# EAGLE board beltpack_v1 (EAGLE 6.6.0)
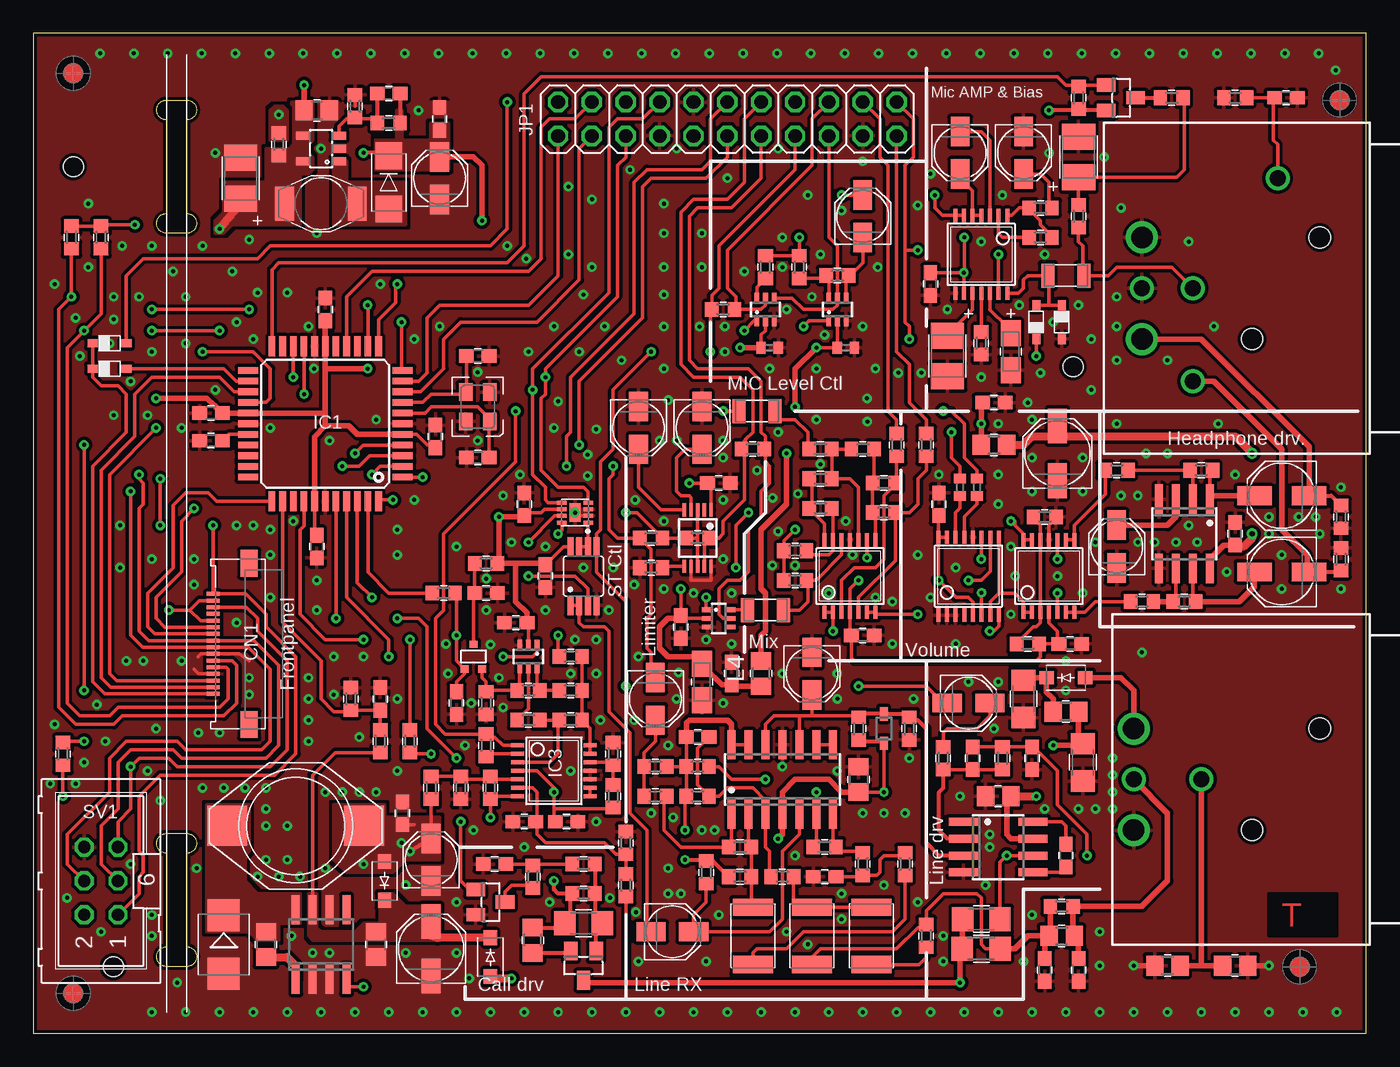
[diagram p5: board, top side]
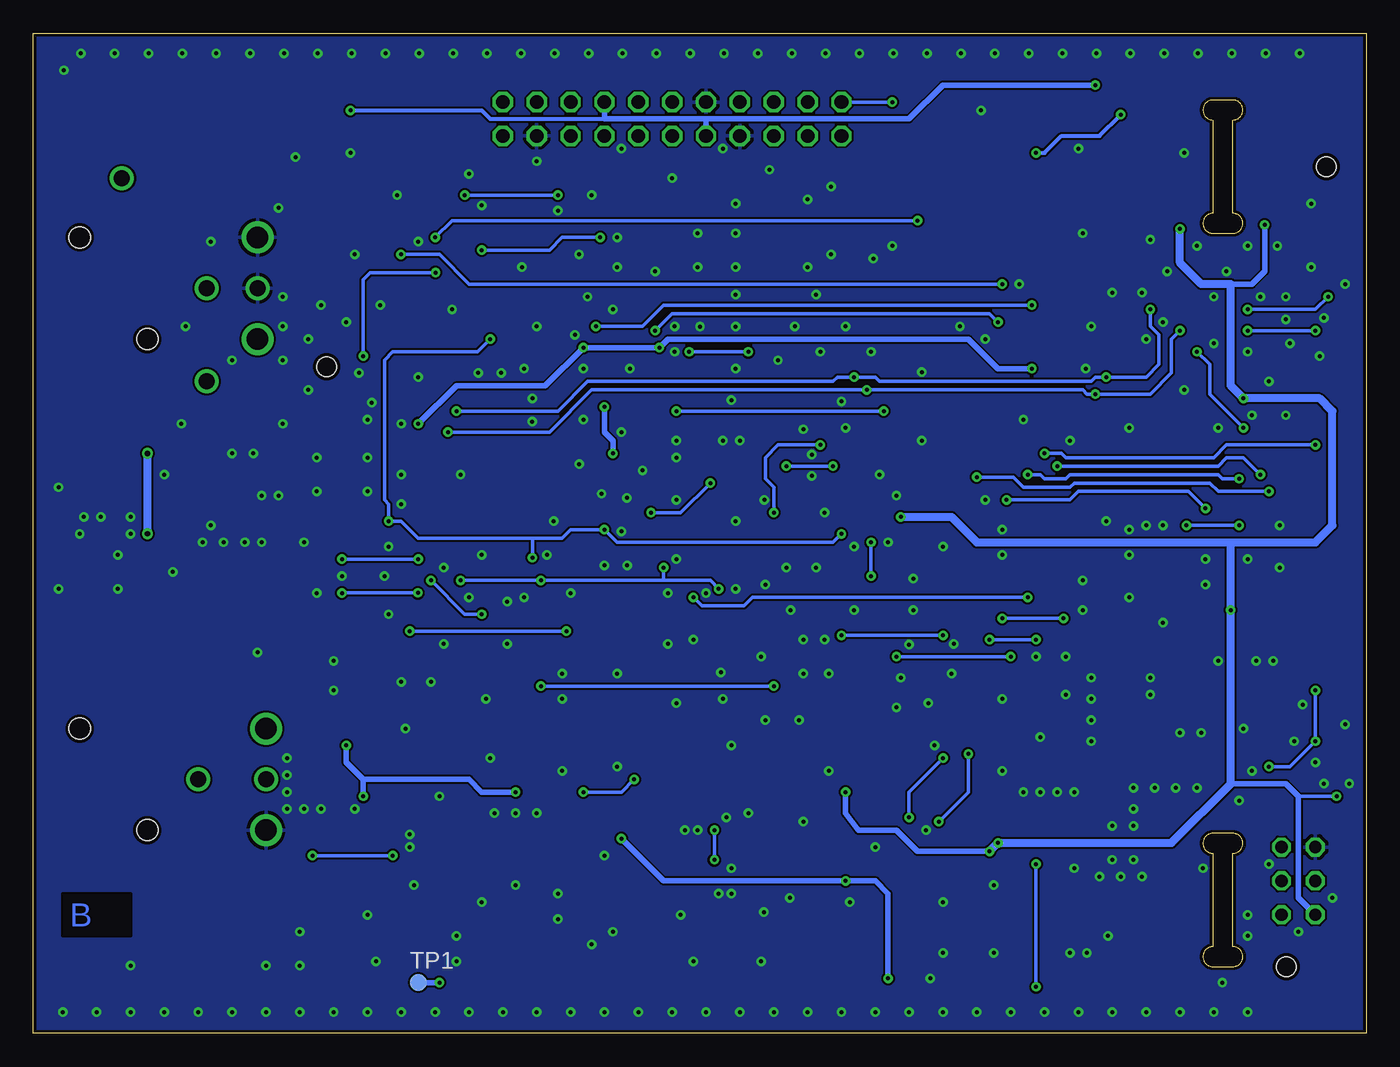
[diagram p6: board, bottom side, seen from below]

Size 100 x 75 mm. Coordinates in mm from the lower left corner, seen from the top.
Outline: 0,0 100,0 100,75 0,75 0,0
Outline: 11.5,5 10,5 arc-90 9.25,5.75 arc-90 10,6.5 10,13.5 arc-90 9.25,14.25 arc-90 10,15 11.5,15 arc-90 12.25,14.25 arc-90 11.5,13.5 11.5,6.5 arc-90 12.25,5.75 arc-90 11.5,5
Outline: 11.5,60 10,60 arc-90 9.25,60.75 arc-90 10,61.5 10,68.5 arc-90 9.25,69.25 arc-90 10,70 11.5,70 arc-90 12.25,69.25 arc-90 11.5,68.5 11.5,61.5 arc-90 12.25,60.75 arc-90 11.5,60
Copper layers (1*16): Top 0.035mm / dielectric 1.5mm / Bottom 0.035mm
Design rules "default *": minimum track width 6mil, minimum drill 0.3mm, track to track 6mil, track to pad 6mil, pad to pad 6mil, via to via 6mil, smd to smd 6mil, copper to edge 0.25mm, drill to drill 8mil, minimum pad ring 10mil, minimum via ring 8mil, stop-mask expansion 4mil, vias tented up to drill 0mil, thermal gap 10mil
Holes 1.5 mm at 3,65 6,5 78,50

## Footprints (pad centres in the part's own frame; a part is rotated, then mirrored left to right if it is on the bottom)
C0603 = smd 1.1 x 1: 1 -0.85,0; 2 0.85,0
C0805 = smd 1.3 x 1.5: 1 -0.95,0; 2 0.95,0
PANASONIC_B = smd 2.2 x 1.4: + 1.6,0; - -1.6,0
C1206 = smd 1.6 x 1.8: 1 -1.4,0; 2 1.4,0
C_PANASONIC_H3 = smd 1 x 1.8: 1 -1.35,0; 2 1.35,0
C0402 = smd 0.7 x 0.9: 1 -0.65,0; 2 0.65,0
PANASONIC_C = smd 2.6 x 1.4: + 2.05,0; - -2.05,0
C_PAN_ECHU_E1 = smd 1.3 x 3: 1 -2.15,0; 2 2.15,0
A/3216-18R = smd 1.95 x 1.5: + 1.375,0; - -1.375,0
B/3528-21R = smd 1.95 x 2.5: + 1.525,0; - -1.525,0
MOLEX-505278-1633 = smd 0.3 x 1: 1 -3.75,1.75; 2 -3.25,1.75; 3 -2.75,1.75; 4 -2.25,1.75; 5 -1.75,1.75; 6 -1.25,1.75; 7 -0.75,1.75; 8 -0.25,1.75; 9 0.25,1.75; 10 0.75,1.75; 11 1.25,1.75; 12 1.75,1.75; 13 2.25,1.75; 14 2.75,1.75; 15 3.25,1.75; 16 3.75,1.75 | smd 2 x 1.3: T1 -6.05,-0.95; T2 6.05,-0.95
SOD323 = smd 1 x 0.6: A 1.1,0; K -1.1,0
DO219AB = smd 1.1 x 1: A -1.45,0; C 1.45,0
SMB = smd 2.4 x 2.4: A 2.2,0; C -2.2,0
SOD323R_INFINEON = smd 0.8 x 0.6: A 1.25,0; C -1.25,0
SMA = smd 2 x 2: A 2,0; C -2,0
TQFP44 = smd 1.5 x 0.5: 1 -5.8,4; 2 -5.8,3.2; 3 -5.8,2.4; 4 -5.8,1.6; 5 -5.8,0.8; 6 -5.8,0; 7 -5.8,-0.8; 8 -5.8,-1.6; 9 -5.8,-2.4; 10 -5.8,-3.2; 11 -5.8,-4; 23 5.8,-4; 24 5.8,-3.2; 25 5.8,-2.4; 26 5.8,-1.6; 27 5.8,-0.8; 28 5.8,0; 29 5.8,0.8; 30 5.8,1.6; 31 5.8,2.4; 32 5.8,3.2; 33 5.8,4 | smd 0.5 x 1.5: 12 -4,-5.8; 13 -3.2,-5.8; 14 -2.4,-5.8; 15 -1.6,-5.8; 16 -0.8,-5.8; 17 0,-5.8; 18 0.8,-5.8; 19 1.6,-5.8; 20 2.4,-5.8; 21 3.2,-5.8; 22 4,-5.8; 34 4,5.8; 35 3.2,5.8; 36 2.4,5.8; 37 1.6,5.8; 38 0.8,5.8; 39 0,5.8; 40 -0.8,5.8; 41 -1.6,5.8; 42 -2.4,5.8; 43 -3.2,5.8; 44 -4,5.8
TSSOP14 = smd 0.305 x 0.991: 1 -1.905,-2.718; 2 -1.27,-2.718; 3 -0.635,-2.718; 4 0,-2.718; 5 0.635,-2.718; 6 1.27,-2.718; 7 1.905,-2.718; 8 1.905,2.718; 9 1.27,2.718; 10 0.635,2.718; 11 0,2.718; 12 -0.635,2.718; 13 -1.27,2.718; 14 -1.905,2.718
TSSOP14' = smd 0.305 x 0.991: 1 -1.95,-2.918; 2 -1.3,-2.918; 3 -0.65,-2.918; 4 0,-2.918; 5 0.65,-2.918; 6 1.3,-2.918; 7 1.95,-2.918; 8 1.95,2.918; 9 1.3,2.918; 10 0.65,2.918; 11 0,2.918; 12 -0.65,2.918; 13 -1.3,2.918; 14 -1.95,2.918
SC70-6L = smd 0.35 x 0.8: 1 -0.65,-0.85; 2 0,-0.85; 3 0.65,-0.85; 4 0.65,0.85; 5 0,0.85; 6 -0.65,0.85
TSSOP16 = smd 0.305 x 0.991: 1 -2.275,-2.918; 2 -1.625,-2.918; 3 -0.975,-2.918; 4 -0.325,-2.918; 5 0.325,-2.918; 6 0.975,-2.918; 7 1.625,-2.918; 8 2.275,-2.918; 9 2.275,2.918; 10 1.625,2.918; 11 0.975,2.918; 12 0.325,2.918; 13 -0.325,2.918; 14 -0.975,2.918; 15 -1.625,2.918; 16 -2.275,2.918
SO08 = smd 0.6 x 2.2: 1 -1.905,-2.6; 2 -0.635,-2.6; 3 0.635,-2.6; 4 1.905,-2.6; 5 1.905,2.6; 6 0.635,2.6; 7 -0.635,2.6; 8 -1.905,2.6
SO14 = smd 0.6 x 2.2: 1 -3.81,-2.6; 2 -2.54,-2.6; 3 -1.27,-2.6; 4 0,-2.6; 5 1.27,-2.6; 6 2.54,-2.6; 7 3.81,-2.6; 8 3.81,2.6; 9 2.54,2.6; 10 1.27,2.6; 11 0,2.6; 12 -1.27,2.6; 13 -2.54,2.6; 14 -3.81,2.6
MSOP10 = smd 0.25 x 1: 1 -1,-2.113; 2 -0.5,-2.113; 3 0,-2.113; 4 0.5,-2.113; 5 1,-2.113; 6 1,2.113; 7 0.5,2.113; 8 0,2.113; 9 -0.5,2.113; 10 -1,2.113
8TDFN-EP = smd 0.7 x 0.3: 1 -0.99,0.75; 2 -0.99,0.25; 3 -0.99,-0.25; 4 -0.99,-0.75; 5 0.99,-0.75; 6 0.99,-0.25; 7 0.99,0.25; 8 0.99,0.75 | smd 0.8 x 1.4: TP 0,0
SOIC8 = smd 0.6 x 2.2: 1 -1.905,-2.6; 2 -0.635,-2.6; 3 0.635,-2.6; 4 1.905,-2.6; 5 1.905,2.6; 6 0.635,2.6; 7 -0.635,2.6; 8 -1.905,2.6
VSOP8 = smd 0.45 x 1.45: 1 -0.975,-2.2; 2 -0.325,-2.2; 3 0.325,-2.2; 4 0.975,-2.2; 5 0.975,2.2; 6 0.325,2.2; 7 -0.325,2.2; 8 -0.975,2.2
SOT23-5 = smd 0.6 x 1.05: 1 -0.95,-1.35; 2 0,-1.35; 3 0.95,-1.35; 4 0.95,1.35; 5 -0.95,1.35
SO-08 = smd 0.6 x 2.2: 1 -1.905,-2.6; 2 -0.635,-2.6; 3 0.635,-2.6; 4 1.905,-2.6; 5 1.905,2.6; 6 0.635,2.6; 7 -0.635,2.6; 8 -1.905,2.6
2X11 = drill 1.016 octagon: 1 -12.7,-1.27; 2 -12.7,1.27; 3 -10.16,-1.27; 4 -10.16,1.27; 5 -7.62,-1.27; 6 -7.62,1.27; 7 -5.08,-1.27; 8 -5.08,1.27; 9 -2.54,-1.27; 10 -2.54,1.27; 11 0,-1.27; 12 0,1.27; 13 2.54,-1.27; 14 2.54,1.27; 15 5.08,-1.27; 16 5.08,1.27; 17 7.62,-1.27; 18 7.62,1.27; 19 10.16,-1.27; 20 10.16,1.27; 21 12.7,-1.27; 22 12.7,1.27
R0805 = smd 1.3 x 1.5: 1 -0.95,0; 2 0.95,0
PISG = smd 1.4 x 2.54: P$1 -2.73,0; P$2 2.73,0
PISM = smd 3 x 3: P$1 -5.15,0; P$2 5.15,0
MT = smd 1.3 x 1: 1 -1.1,-0.9; 2 1.1,-0.9; 3 1.1,0.9; 4 -1.1,0.9
R0603 = smd 1 x 1.1: 1 -0.85,0; 2 0.85,0
R0402 = smd 0.7 x 0.9: 1 -0.65,0; 2 0.65,0
R1206 = smd 1.6 x 1.803: 1 -1.422,0; 2 1.422,0
ML6 = drill 0.914 octagon: 1 -2.54,-1.27; 2 -2.54,1.27; 3 0,-1.27; 4 0,1.27; 5 2.54,-1.27; 6 2.54,1.27
SOT23 = smd 1 x 1.4: 1 -0.95,-1.1; 2 0.95,-1.1; 3 0,1.1
SC70 = smd 0.6 x 0.55: 1 -0.65,-0.925; 2 0.65,-0.925; 3 0,0.925
B1,27 = smd 1.27 x 1.27: TP 0,0
NC3MBH = drill 1.6: 1 3.81,0; 2 -3.81,0 | drill 1.2: 3 0,0; G 0,5.08 | hole 1.6: -3.81,13.97; 3.81,8.89
NC5FAH = drill 1.6: 1 -3.81,-3.815; 5 3.81,-3.815 | drill 1.2: 2 0,0; 3 0,-3.815; 4 6.98,0; G -8.25,6.355 | hole 1.6: 3.81,4.445; -3.81,9.525

## Placement (x,y rotation side)
C1  22p  [C0603]  33.34,43.18 180 top
C2  22p  [C0603]  33.34,50.8 0 top
C3  100n  [C0603]  30.16,44.77 90 top
C4  10n  [C0603]  31.75,24.77 270 top
C5  100n  [C0603]  21.91,54.29 90 top
C6  100n  [C0603]  13.34,44.45 180 top
C7  100n  [C0603]  13.34,46.52 180 top
C8  100n  [C0603]  21.27,36.51 270 top
C9  100n  [C0603]  36.2,30.8 180 top
C10  100n  [C0603]  26.04,25.08 90 top
C11  100n  [C0603]  40.01,15.88 0 top
C12  100n  [C0603]  33.97,33.02 0 top
C13  10n  [C0603]  36.83,15.88 180 top
C14  100n  [C0603]  62.23,29.84 0 top
C15  100n  [C0603]  77.79,29.21 0 top
C16  10n  [C0805]  90.17,5.08 180 top
C17  1µ  [PANASONIC_B]  70.17,24.77 0 top
C18  47p  [C0603]  78.42,4.76 270 top
C19  47p  [C0603]  75.88,4.76 270 top
C20  4µ7  [PANASONIC_B]  58.42,26.99 270 top
C21  100n/50V  [C0805]  72.39,17.78 180 top
C22  39p  [C0603]  70.48,20.64 270 top
C23  1µ  [PANASONIC_B]  47.94,7.62 0 top
C24  20p  [C0603]  77.47,13.34 270 top
C25  39p  [C0603]  74.93,20.64 270 top
C26  1µ/50V  [C1206]  71.12,8.57 180 top
C27  100n/50V  [C0805]  61.91,19.05 90 top
C28  680p  [C0603]  59.37,11.75 0 top
C29  470n ECPU1C474MA5  [C_PANASONIC_H3]  54.29,46.67 0 top
C30  100n  [C0603]  67.94,39.69 90 top
C31  100n/100V  [C1206]  78.74,20.32 270 top
C32  15p  [C0603]  49.85,22.23 180 top
C33  100n  [C0603]  34.61,12.7 180 top
C34  1µ/50V  [C1206]  41.27,8.26 0 top
C35  10µ  [PANASONIC_B]  46.67,25.08 270 top
C36  1µ  [PANASONIC_B]  50.16,45.4 270 top
C37  10µ  [PANASONIC_B]  45.4,45.4 270 top
C38  100n  [C0402]  55.24,51.44 0 top
C39  100n  [C0603]  51.44,41.27 0 top
C40  100n  [C0603]  48.58,30.48 270 top
C41  470n ECPU1C474MA5  [C_PANASONIC_H3]  54.93,31.75 0 top
C42  100n/100V  [C1206]  74.3,25.08 270 top
C43  100n  [C0603]  27.7,16.51 90 top
C44  47µ  [PANASONIC_B]  29.84,13.02 90 top
C45  10µ  [PANASONIC_C]  29.84,6.35 90 top
C46  100n/50V  [C0805]  25.72,6.67 270 top
C47  TMK107BBJ475MA-T  [PANASONIC_B]  30.48,64.14 90 top
C48  470n ECPU1C474MA5  [C_PANASONIC_H3]  77.47,56.83 180 top
C49  10µ  [PANASONIC_B]  74.3,66.04 270 top
C50  1µ  [PANASONIC_B]  81.28,36.51 90 top
C51  100n  [C0603]  90.17,37.47 90 top
C52  100n  [C0603]  72.07,47.31 0 top
C53  22µ  [PANASONIC_C]  76.83,43.5 90 top
C54  100µ/16  [PANASONIC_C]  93.66,40.32 180 top
C55  100µ/16  [PANASONIC_C]  93.66,34.61 180 top
C56  47n/50V  [C_PAN_ECHU_E1]  58.42,7.3 90 top
C57  47n/50V  [C_PAN_ECHU_E1]  53.98,7.3 90 top
C58  47n/50V  [C_PAN_ECHU_E1]  62.87,7.3 90 top
C59  1µ/16  [A/3216-18R]  73.34,51.12 90 top
C60  1µ  [PANASONIC_B]  62.23,61.28 90 top
C61  1µ  [PANASONIC_B]  69.53,66.04 270 top
C62  10µ/20  [B/3528-21R]  68.58,50.8 90 top
C63  100n  [C0402]  60.96,51.44 180 top
C64  100n  [C0603]  67.31,56.2 90 top
C65  1n  [C0603]  93.98,70.17 0 top
C66  1µ/35  [B/3528-21R]  78.42,65.72 270 top
C67  100n  [C0603]  36.83,39.69 90 top
C68  100n  [C0603]  38.42,34.29 270 top
C69  100n  [C0603]  52.39,26.99 90 top
C70  10µ/10V  [A/3216-18R]  50.16,26.35 90 top
C101  22/16  [B/3528-21R]  15.56,64.14 270 top
C102  100n/50  [C0805]  21.27,69.22 0 top
C103  NP  [C0603]  26.67,70.48 180 top
C104  100n  [C0603]  30.48,68.58 90 top
C3007  10nF  [C0805]  17.46,6.67 90 top
CN1  Frontpanel  [MOLEX-505278-1633]  15.24,29.21 90 top
D1  1N4148-WS  [SOD323]  63.82,22.86 90 top
D2  S1GL  [DO219AB]  77.47,26.67 180 top
D3  S1GL  [DO219AB]  26.35,11.43 270 top
D4  MBRS160  [SMB]  14.29,6.67 270 top
D5  BAT42WS  [SOD323R_INFINEON]  75.25,53.34 90 top
D6  BAT42WS  [SOD323R_INFINEON]  77.15,53.34 270 top
D7  BAT42WS  [SOD323R_INFINEON]  5.71,51.75 0 top
D8  BAT42WS  [SOD323R_INFINEON]  5.71,49.85 0 top
D9  S1GL  [DO219AB]  34.29,5.71 90 top
D101  SS16T3  [SMA]  26.67,63.82 270 top
IC1  MEGA32-A  [TQFP44]  21.91,45.72 180 top
IC2  LMV324MZ  [TSSOP14]  61.28,34.29 0 top
IC3  LMV324MZ  [TSSOP14]  39.05,19.68 270 top
IC4  NJM2783  [TSSOP14']  71.12,58.42 180 top
IC5  TS5A9411DCK  [SC70-6L]  37.15,28.26 180 top
IC6  DS1881E  [TSSOP16]  70.17,34.29 0 top
IC7  NE5534D  [SO08]  72.39,13.97 270 top
IC8  TL074D  [SO14]  56.2,19.05 0 top
IC9  NJM2762RB2  [MSOP10]  49.85,37.15 180 top
IC10  TS5A9411DCK  [SC70-6L]  54.93,54.29 0 top
IC11  TS5A9411DCK  [SC70-6L]  51.44,31.11 270 top
IC12  MAX5395LATA+P  [8TDFN-EP]  40.64,39.05 180 top
IC13  LMV324MZ  [TSSOP14]  76.2,34.29 0 top
IC15  TS5A9411DCK  [SC70-6L]  60.33,54.29 0 top
IC16  LM4880M  [SOIC8]  86.36,37.47 180 top
IC17  LMV358DGK  [VSOP8]  41.27,34.29 0 top
IC101  LMR64010  [SOT23-5]  21.59,66.36 90 top
IC3001  LM2675-5.0  [SO-08]  21.59,6.67 0 top
JP1  [2X11]  52.07,68.58 0 top
L1  L200R  [R0805]  77.15,7.3 0 top
L2  L200R  [R0805]  72.07,44.13 0 top
L3  200R  [R0805]  77.47,24.13 180 top
L4  200R  [R0805]  54.61,26.99 90 top
L101  22µH  [PISG]  21.59,62.23 0 top
L3001  47µH  [PISM]  19.68,15.56 0 top
Q1  16M  [MT]  33.34,46.99 90 top
R1  4k7  [R0603]  30.8,33.02 0 top
R2  470  [R0603]  33.97,24.77 90 top
R3  22k  [R0603]  2.22,20.95 90 top
R4  47k  [R0603]  40.32,28.26 0 top
R5  6k8  [R0603]  37.15,25.72 180 top
R6  1k  [R0603]  40.32,25.72 180 top
R7  22  [R0402]  69.53,40.96 270 top
R8  22  [R0402]  70.8,40.96 270 top
R9  220k  [R0603]  40.32,23.5 180 top
R10  2k2  [R0603]  37.15,23.5 0 top
R11  2k2  [R0603]  33.97,21.59 90 top
R12  15k  [R0603]  26.04,21.91 270 top
R13  1k  [R0603]  23.81,25.08 270 top
R14  22k  [R0603]  29.84,18.41 270 top
R15  2k2  [R0603]  32.07,18.41 90 top
R16  22k  [R0603]  44.45,11.11 270 top
R17  2k2  [R0603]  44.45,14.29 270 top
R18  100k  [R0603]  34.29,18.41 270 top
R19  NB  [R0603]  49.85,37.15 0 top
R20  2k2  [R0603]  43.5,17.78 270 top
R21  2k2  [R0603]  43.5,20.95 270 top
R22  100  [R0603]  33.97,35.24 0 top
R23  22k  [R0603]  71.12,51.75 90 top
R24  NB  [R0603]  18.41,66.67 90 top
R25  10k  [R0603]  75.56,59.69 180 top
R26  330  [R0603]  75.56,61.91 180 top
R27  2k2  [R0603]  60.33,56.83 180 top
R28  100k  [R0603]  90.17,70.17 0 top
R29  220k  [R0603]  61.91,22.86 270 top
R30  220k  [R0603]  65.72,22.86 90 top
R31  100k  [R0805]  85.09,5.08 180 top
R32  10k  [R0603]  68.26,20.64 270 top
R33  470  [R0603]  77.15,9.53 180 top
R35  1k  [R0603]  57.47,57.47 90 top
R36  10k  [R0603]  72.71,20.64 90 top
R37  47k  [R0603]  50.48,12.06 270 top
R38  2k2  [R0603]  49.85,20 0 top
R39  2k2  [R0603]  59.37,13.97 0 top
R40  1k5  [R1206]  71.12,6.35 0 top
R41  2k2  [R0603]  62.23,12.7 270 top
R42  56k  [R0603]  65.41,12.7 90 top
R43  0  [R0603]  51.75,54.29 180 top
R44  6k8  [R0603]  53.02,11.75 180 top
R45  43k  [R0603]  56.2,11.75 180 top
R46  10k  [R0603]  28.26,21.91 270 top
R47  68k  [R0603]  49.85,17.78 0 top
R48  20k  [R0603]  53.02,13.97 0 top
R49  47k  [R0603]  37.47,11.75 90 top
R50  47k  [R0603]  41.27,12.7 0 top
R51  1k5  [R0603]  46.67,17.78 180 top
R52  2k2  [R0603]  46.67,20 180 top
R53  18k  [R0603]  41.27,10.48 180 top
R54  470  [R0805]  37.47,6.99 90 top
R55  0  [R0603]  46.35,37.15 180 top
R56  22k  [R0603]  46.35,34.92 0 top
R57  22k  [R0603]  54.93,57.47 270 top
R58  0  [R0603]  53.98,43.81 0 top
R59  100k  [R0603]  57.15,33.97 180 top
R60  4k7  [R0603]  57.15,36.2 0 top
R61  47k  [R0603]  59.05,39.37 180 top
R62  33k  [R0603]  59.05,43.81 0 top
R63  22k  [R0603]  59.05,41.59 0 top
R64  NB  [R0603]  62.23,43.81 0 top
R65  1k  [R0603]  66.99,44.13 270 top
R66  1k  [R0603]  64.77,44.13 270 top
R67  1k  [R0603]  63.82,39.05 0 top
R68  1k  [R0603]  63.82,41.27 0 top
R69  10k  [R0603]  78.42,61.28 90 top
R70  100  [R0603]  85.41,70.17 180 top
R71  22k  [R0603]  78.42,70.17 270 top
R72  10k  [R0603]  5.08,59.69 90 top
R73  10k  [R0603]  2.86,59.69 90 top
R74  10k  [R0603]  75.88,38.73 180 top
R75  22k  [R0603]  81.28,42.23 0 top
R76  22k  [R0603]  83.19,32.38 0 top
R77  10k  [R0603]  74.61,29.21 0 top
R78  22k  [R0603]  87.63,42.23 0 top
R79  22k  [R0603]  86.36,32.38 0 top
R80  22k  [R0603]  98.11,38.73 90 top
R81  22k  [R0603]  98.11,35.56 270 top
R82  47k  [R0603]  66.99,7.3 270 top
R102  1k  [R0603]  24.13,69.53 270 top
R103  5k1  [R0603]  26.67,68.26 0 top
SV1  ISP  [ML6]  5.08,11.43 90 top
T2  BC847  [SOT23]  34.29,9.84 270 top
T3  MMBTA92  [SOT23]  41.27,5.08 180 top
T4  BC847-SC70  [SC70]  33.02,28.26 0 top
T5  IRLML5203  [SOT23]  81.6,70.17 270 top
TP1  XA  [B1,27]  71.12,3.81 0 bottom
U$1  [FIDUCIAL_G15]  3,3 0 top
U$2  [FIDUCIAL_G15]  3,72 0 top
U$3  [FIDUCIAL_G15]  95,5 0 top
U$4  [FIDUCIAL_G15]  98,70 0 top
X2  NC3MBH  [NC3MBH]  82.55,19.05 270 top
X3  NC5FAH  [NC5FAH]  87,55.88 270 top

## Tracks (layer width: path | path; a pad name or v marks a point on that pad's centre or on a via)
2V5_A  (via drill 0.3)
  Top 0.254: IC13.13 IC13.14 74.3,37.47 73.66,38.1 73.66,38.42 v73.34,38.42 | R59.2 R60.1 56.3,36.93 v57.15,37.78 | IC2.9 v62.55,35.67 | 65.41,58.74 65.41,65.09 66.04,65.72 66.04,68.58 JP1.22 | 65.41,58.74 65.41,53.34 65.72,53.02 v65.72,52.07 | v57.47,59.69 R35.2 R57.1 55.14,58.42 | v66.36,58.74 65.41,58.74 | IC12.8 39.65,37.74 v39.37,37.47
  Bottom 0.254: 62.55,37.15 60.33,37.15 59.69,37.78 v57.15,37.78 56.2,36.83 40.01,36.83 v39.37,37.47 | 62.55,37.15 71.12,37.15 72.39,38.42 v73.34,38.42 73.34,39.69 73.66,40.01 73.66,50.48 73.03,51.12 66.67,51.12 v65.72,52.07 | v62.55,35.67 62.55,37.15 | v57.47,59.69 60.33,59.69 61.28,58.74 v66.36,58.74
2V5_D
  Top 0.254: IC3.13 IC3.14 41.77,22.9 R9.1 R6.1 R4.2
!AVR_CS0!  (via drill 0.3)
  Top 0.254: IC1.44 25.95,39.92 26.04,40.01 v26.99,40.01 | CN1.11 9.86,30.46 9.21,31.11 9.21,32.7 11.11,34.61 11.11,38.42 v12.06,39.37
  Bottom 0.254: v26.99,40.01 22.23,40.01 21.59,40.64 13.34,40.64 v12.06,39.37
!AVR_RST!  (via drill 0.3)
  Top 0.254: IC1.4 24.75,44.12 v24.13,43.5 | v3.81,44.13 v3.81,25.72 | CN1.14 15.98,31.96 16.83,31.11 16.83,30.16 19.05,27.94 19.05,21.27 17.78,20 10.79,20 10.16,20.64 7.94,20.64 v7.3,20 7.3,16.83 6.35,15.88 SV1.5 | R3.2 2.22,21.91 v3.81,21.91
  Bottom 0.254: v24.13,43.5 22.86,43.5 22.54,43.18 11.43,43.18 10.48,44.13 v3.81,44.13 | v3.81,25.72 v3.81,21.91 5.71,20 v7.3,20
!CALL_IN!  (via drill 0.3)
  Top 0.254: IC1.40 v22.71,31.11 | v34.29,16.19 R18.2 34.19,17.78 IC3.7 | v31.75,20.64 29.53,22.86 29.53,30.48 28.89,31.11 v27.3,31.11
  Bottom 0.254: v34.29,16.19 34.29,18.1 v31.75,20.64 | v22.71,31.11 v27.3,31.11
!DRST!
  Top 0.254: IC1.34 13.74,39.92 13.1,40.55 11.43,40.55 10.48,39.6 10.48,34.92 8.57,33.02 8.57,30.48 9.09,29.96 CN1.10
!MUTE_LINE!  (via drill 0.3)
  Top 0.254: IC11.1 50.5,31.77 50.48,31.75 v50.48,32.7 | IC1.42 24.31,33.8 v25.4,32.7
  Bottom 0.254: v50.48,32.7 49.85,32.07 46.67,32.07 46.04,32.7 v25.4,32.7
!PHANTOM_ON!
  Top 0.254: 78.74,71.12 77.47,71.12 76.83,71.75 38.1,71.75 36.83,70.48 36.83,59.05 35.56,57.78 18.41,57.78 17.91,57.28 IC1.22 | 78.74,71.12 T5.1 | R71.1 78.64,71.02 78.74,71.12
!PON!  (via drill 0.3)
  Top 0.254: v35.56,69.85 35.56,60.33 34.29,59.05 17.78,59.05 16.83,58.1 8.26,58.1 6.96,56.81 D7.A
  Bottom 0.254: JP1.2 v35.56,69.85
+5V  (via drill 0.3)
  Top 0.254: IC6.16 67.89,38.78 C30.1 | IC6.15 IC6.16 | IC6.16 67.89,34.34 v67.94,33.97 69.22,32.7 70.17,32.7 70.49,32.38 IC6.5 | v61.91,33.97 61.28,33.34 IC2.4 61.28,29.95 C14.1 61.38,28.16 61.59,27.94 75.25,27.94 75.56,28.26 75.56,29.11 R77.2 C15.1 76.83,29.31 76.83,30.16 76.2,30.8 IC13.4 | IC11.2 48.79,31.11 C40.1 | C39.1 50.85,41.01 IC9.1 50.85,41.23 50.8,41.27 v49.21,41.27 | C40.1 48.58,31.11 | v48.58,33.34 C40.1 | v52.7,34.92 52.7,38.1 v53.66,39.05
  Top 0.406: C40.1 48.36,31.11 47.62,31.11 46.99,30.48 46.99,28.89 47.62,28.26 49.85,28.26 50.16,27.94 C70.+ 50.48,27.41 50.48,27.3 51.65,26.14 C69.1 52.49,26.04 L4.1
  Bottom 0.254: v67.94,33.97 v61.91,33.97 52.7,33.97 | 52.7,33.97 49.21,33.97 v48.58,33.34 | 52.7,33.97 v52.7,34.92 | v53.66,39.05 51.44,39.05 v49.21,41.27
+5VA
  Top 0.254: R22.1 C12.1 33.02,32.92 T4.3
+9V  (via drill 0.3)
  Top 0.254: v69.82,57.05 IC4.9 | v69.82,57.05 C64.2 | v69.85,59.69 69.85,57.08 v69.82,57.05 | v75.25,50.8 D5.C
  Top 0.305: R103.2 C103.1 27.62,70.59 | D101.C 26.67,66.04 v24.77,66.04
  Top 0.406: C47.+ 33.01,65.73 33.66,65.09 v33.66,60.96
  Bottom 0.254: v69.82,57.05 74.72,57.05 75.25,56.52 v75.25,50.8 | v33.66,60.96 68.58,60.96 v69.85,59.69
  Bottom 0.305: v24.77,66.04 24.13,66.04 22.86,67.31 20,67.31 v18.41,68.9
  pour Top (rank 3, no thermals): 25.72,64.77 25.72,66.99 27.3,66.99 27.3,69.22 27.62,69.22 27.62,66.99 29.84,66.99 29.84,68.26 31.11,68.26 31.11,64.77
  pour Top (rank 2, no thermals): 17.78,66.99 19.05,66.99 19.05,69.22 18.73,69.53 18.1,69.53 17.78,69.22
ABEEP
  Top 0.254: IC1.43 25.11,34.58 26.67,33.02 R1.1
AGND  (via drill 0.3)
  Top 0.254: IC8.13 IC8.14 | R52.1 R38.1 | R38.1 R47.1 48.9,17.78 v48.9,15.24 | R38.1 C32.2
  Top 0.305: v48.9,13.02 50.38,13.02 R37.1 51.01,12.91 R44.2
  Top 0.406: C32.2 49,23.28 49.21,23.5 52.07,23.5 52.39,23.18 IC8.14
  Bottom 0.254: v48.9,15.24 v48.9,13.02
AVR_MISO  (via drill 0.3)
  Top 0.254: IC1.2 26.01,42.52 v25.4,41.91 | v9.53,38.1 v9.53,41.59 | v13.49,38.1 CN1.16 15.94,32.96 17.46,31.43 17.46,30.48 19.68,28.26 19.68,20.95 18.1,19.37 9.53,19.37 7.94,17.78 7.94,13.65 8.26,13.34 8.26,12.06 7.94,11.75 7.94,10.48 SV1.1
  Bottom 0.254: v25.4,41.91 24.45,41.91 24.13,41.59 22.54,41.59 22.23,41.91 11.11,41.91 10.79,41.59 v9.53,41.59 | v13.49,38.1 v9.53,38.1
AVR_MOSI  (via drill 0.3)
  Top 0.254: IC1.1 v29.21,41.72 | v7.3,40.64 7.3,29.84 8.19,28.96 CN1.8 16.12,28.96 17.78,27.3 17.78,21.91 17.14,21.27 11.43,21.27 10.79,21.91 6.99,21.91 5.71,20.64 5.71,18.1 2.54,14.92 2.54,12.7 SV1.4
  Bottom 0.254: v29.21,41.72 26.48,41.72 25.72,40.96 22.23,40.96 21.91,41.27 11.75,41.27 11.11,40.64 v7.3,40.64
AVR_RXD
  Top 0.254: IC1.9 29.07,48.12 30.8,49.85 30.8,52.07 32.07,53.34 37.78,53.34 40.96,56.52 40.96,66.36 JP1.3
AVR_SCK  (via drill 0.3)
  Top 0.254: IC1.3 25.22,43.32 24.45,42.55 v23.18,42.55 | v7.94,41.91 7.94,41.59 8.26,41.27 8.26,39.69 7.94,39.37 7.94,30.16 8.64,29.46 CN1.9 16.58,29.46 18.41,27.62 18.41,21.59 17.46,20.64 11.11,20.64 10.48,21.27 7.3,21.27 6.35,20.32 6.35,16.83 5.08,15.56 5.08,12.7 SV1.3
  Bottom 0.254: v23.18,42.55 11.11,42.55 10.48,43.18 9.21,43.18 v7.94,41.91
AVR_TXD
  Top 0.254: IC1.10 28.92,48.92 29.53,49.53 29.53,53.66 30.48,54.61 37.15,54.61 39.37,56.83 JP1.1
BEEP-18  (via drill 0.3)
  Top 0.254: IC5.1 37.8,28.59 37.47,28.26 v35.24,28.26 | IC1.41 23.51,32.69 26.67,29.53 v26.67,28.26
  Bottom 0.254: v35.24,28.26 v26.67,28.26
BEEP_A
  Top 0.254: IC5.4 36.5,25.92 R5.2 34.08,25.72 R2.2 33.97,26.35 33.67,26.66 T4.2
BEEP_AUDIO  (via drill 0.3)
  Top 0.254: IC3.1 35.24,21.59 34.61,22.23 34.19,22.23 R11.2 30.9,22.44 30.16,23.18 30.16,31.11 30.8,31.75 30.8,37.47 36.2,42.86 v36.2,46.67 | C29.1 v51.75,46.67
  Bottom 0.254: v51.75,46.67 v36.2,46.67
CALL_DRV  (via drill 0.3)
  Top 0.254: IC1.37 20.31,38.09 20,37.78 20,31.43 21.91,29.53 v24.77,29.53 | R46.1 v28.26,29.53
  Bottom 0.254: v28.26,29.53 v24.77,29.53
ENC_A  (via drill 0.3)
  Top 0.254: CN1.3 6.24,26.46 5.71,26.99 5.71,41.91 v9.21,45.4 | IC1.26 17.48,47.32 17.78,47.62 17.78,49.85 16.51,51.12 v12.7,51.12
  Bottom 0.254: v12.7,51.12 11.75,50.16 11.75,47.94 v9.21,45.4
ENC_B
  Top 0.254: IC1.25 15.06,48.12 13.97,49.21 8.89,49.21 7.62,47.94 7.62,44.77 5.08,42.23 5.08,26.67 5.79,25.96 CN1.2
ENC_BTN
  Top 0.254: IC1.24 15.21,48.92 14.29,49.85 D8.A
ENC_C
  Top 0.254: CN1.1 5.34,25.46 4.45,26.35 4.45,42.55 6.99,45.09 6.99,47.94 6.35,48.58 5.08,48.58 4.45,49.21 4.45,49.83 D8.C D7.C
EXT_AUDIO_L
  Top 0.254: R65.1 66.99,46.04 65.72,47.31 65.72,50.16 64.77,51.12 JP1.21
EXT_AUDIO_R
  Top 0.254: R66.1 64.77,46.04 64.14,46.67 64.14,65.09 63.5,65.72 63.5,68.58 JP1.20
GND  (via drill 0.3)
  Top 0.254: IC9.7 49.35,33.97 50.85,33.97 IC9.10 | R102.1 24.13,69.53 | IC12.2 40.89,38.8 IC12.TP | 16.19,27.94 15.44,28.46 CN1.7 12.59,28.46 12.38,28.26 | CN1.4 12.41,26.96 12.06,27.3 | 76.2,36.83 76.2,38.1 76.83,38.73
  Top 0.406: C16.1 v92.71,5.08 | R31.2 v82.55,5.08
  other vias: 50.16,15.24 51.44,8.89 84.14,36.83 85.72,36.83 87.31,36.83 98.11,40.96 98.11,33.34 81.28,45.72 60.33,19.68 56.2,20 65.72,20.64 69.53,17.78 71.75,13.97 71.75,14.92 71.44,11.11 88.9,45.72 90.17,41.91 93.66,35.88 92.71,37.47 92.71,38.73 94.93,38.73 96.2,38.73 96.52,37.47 93.66,33.34 50.48,29.53 79.69,36.83 76.83,34.29 83.19,28.57 63.18,32.7 72.39,39.69 73.66,34.29 64.45,29.21 64.45,32.38 60.96,38.42 69.22,34.92 67.94,41.91 78.74,40.64 78.74,43.18 74.93,43.18 74.93,40.64 59.69,33.02 61.47,35.88 66.36,35.88 47.62,21.59 45.09,23.5 48.26,25.08 51.75,35.56 51.75,40.01 55.88,37.65 54.29,42.23 57.37,40.47 57.15,13.34 63.82,16.51 65.41,16.51 62.23,16.51 31.75,1.59 34.29,1.59 36.83,1.59 39.37,1.59 41.91,1.59 44.45,1.59 46.99,1.59 49.53,1.59 52.07,1.59 54.61,1.59 57.15,1.59 59.69,1.59 62.23,1.59 64.77,1.59 67.31,1.59 69.85,1.59 72.39,1.59 74.93,1.59 77.47,1.59 80.01,1.59 82.55,1.59 85.09,1.59 87.63,1.59 90.17,1.59 92.71,1.59 95.25,1.59 97.79,1.59 40.32,19.68 47.62,12.38 47.62,10.48 48,16.19 45.2,9.1 48.58,10.48 51.12,15.24 45.09,33.66 51.75,43.18 51.75,44.45 48.26,44.45 62.56,45.88 62.55,47.62 72.39,41.91 74.93,46.04 72.39,45.72 47.31,38.42 66.04,25.08 70.17,26.35 72.07,22.86 56.2,26.99 60.33,26.99 60.33,25.08 64.9,49.53 63.18,49.85 80.01,7.62 80.01,5.08 74.93,8.89 68.26,5.4 68.26,7.3 74.3,5.4 50.48,5.4 45.4,5.4 56.52,7.62 32.7,4.13 75.88,16.83 78.42,16.83 79.69,16.83 80.96,16.83 80.96,18.1 80.96,19.37 80.96,20.64 77.47,25.72 77.47,27.94 72.39,26.35 82.87,40.32 82.87,36.83 86.68,38.1 81.6,40.32 83.5,43.5 85.09,43.5 27.3,37.78 29.21,1.59 26.67,1.59 24.13,1.59 21.59,1.59 19.05,1.59 16.51,1.59 13.97,1.59 11.43,1.59 8.89,1.59 22.23,6.03 20.95,6.03 38.73,9.84 36.83,13.97 46.35,16.51 42.23,15.88 35.24,24.45 33.97,31.75 33.97,34.1 34.29,29.15 40.32,26.99 40.64,29.53 34.92,26.67 47.31,33.34 45.4,28.26 60.64,10.48 49.53,33.02 52.39,33.02 45.15,40.01 21.59,66.36 5,73.5 7.54,73.5 10.08,73.5 12.62,73.5 15.16,73.5 17.7,73.5 20.24,73.5 22.78,73.5 25.32,73.5 27.86,73.5 30.4,73.5 32.94,73.5 35.48,73.5 38.02,73.5 40.56,73.5 43.1,73.5 45.64,73.5 48.18,73.5 50.72,73.5 53.26,73.5 55.8,73.5 58.34,73.5 60.88,73.5 63.42,73.5 65.96,73.5 68.5,73.5 71.04,73.5 73.58,73.5 76.12,73.5 78.66,73.5 81.2,73.5 83.74,73.5 86.28,73.5 88.82,73.5 91.36,73.5 93.9,73.5 96.44,73.5 97.71,72.23 73.98,54.61 71.12,59.37 68.58,54.29 78.42,54.61 76.52,53.34 66.36,62.1 58.74,49.85 62.23,53.02 56.52,54.29 62.23,65.41 74.61,47.31 71.12,49.21 75.56,49.53 79.38,52.07 86.68,59.37 81.6,61.91 81.28,55.24 81.28,53.02 88.58,53.02 85.09,50.48 81.28,50.48 55.88,66.36 48.26,66.36 55.88,45.09 19.37,7.3 46.99,44.45 21.91,18.1 19.05,15.56 21.27,33.97 19.05,13.02 21.91,12.38 16.83,11.75 20,11.75 18.41,11.75 17.46,13.02 17.46,15.56 17.46,16.83 43.18,31.75 40.64,39.05 38.42,31.75 42.86,53.02 39.05,45.4 36.51,41.91 41.59,43.4 30.95,29.21 31.11,26.99 42.23,29.53 42.23,26.99 42.55,23.5 66.62,49.53 75.88,58.42 47.31,60.01 50.16,57.47 50.16,60.01 47.31,62.23 52.07,64.14 53.34,57.15 56.2,59.69 59.05,58.42 47.31,57.47 58.1,62.87 60.64,61.7 63.35,57.47 47.31,55.4 47.62,47.5 44.13,50.48 58.42,55.24 49.98,53 51.88,53.02 56.2,57.47 47.31,49.85 47.31,53 51.88,51.12 32.85,24.77 43.25,10.16 67.31,64.45 32.38,21.59 41.59,41.81 42.23,45.3 35.88,36.83 38.42,36.51 48.42,27.07 73.34,31.43 55.24,49.85 59.37,52.39 58.74,46.04 59.05,42.69 55.47,40.15 51.75,24.77 52.39,29.21 55.45,35.1 57.15,35.1 89.53,34.61 40.96,51.12 39.37,47.4 35.24,40.32 39.05,53.02 37.15,51.12 41.27,55.4 41.91,57.47 58.1,6.67 60.64,8.57 66.36,9.84 63.82,11.11 28.57,40.01 40.15,58.42 72.71,62.87 76.2,66.04 80.33,65.72 21.05,49.85 20.64,53.02 17.78,45.4 22.23,44.45 30.48,53.02 33.34,44.45 33.34,49.6 27.3,35.88 31.75,36.51 17.78,37.78 17.78,35.88 11.11,45.4 7.3,48.9 8.57,46.35 6.03,46.35 13.65,48.26 6.99,27.94 8.26,27.94 11.11,27.94 6.5,34.92 6.5,38.1 12.06,35.56 12.06,33.66 16.51,38.1 15.24,38.1 5.71,51.75 1.59,56.2 7.94,55.24 8.89,51.12 11.43,55.24 11.43,51.75 15.24,53.34 16.51,52.07 8.89,35.56 21.27,31.75 24.77,28.26 27.3,25.08 24.45,22.23 27.3,19.68 22.54,25.4 4.13,57.47 67.31,32.7 69.22,29.21 73.34,36.51 78.74,33.02 16.19,26.67 16.19,25.4 15.24,30.8 9.53,17.46 12.7,18.41 14.29,18.41 15.88,18.41 17.46,18.41 12.38,22.54 13.97,22.54 5.4,21.91 1.59,23.18 8.89,7.3 8.89,8.89 8.57,19.68 2.54,10.16 5.08,7.62 6.67,59.05 10.48,57.15 4.76,24.65 9.21,22.86 3.81,20.32 1.27,18.73 3.17,18.73 33.02,15.24 23.18,18.1 24.45,18.1 25.72,18.1 27.94,11.11 31.75,9.84 31.75,6.03 27.94,6.03 12.7,59.05 8.89,59.05 25.72,46.04 28.57,52.07 10.79,3.81 40.15,63.5 41.91,62.55 44.77,64.77 36.98,58.1 35.56,59.05 79.38,48.26 7.3,12.7 12.25,12.38 3.49,50.8 6.03,53.55 6.03,55.24 16.83,55.56 19.05,55.56 26.04,56.2 3.17,53.66 4.13,62.23 16.19,59.53 14.92,57.15 21.27,60.01 13.65,66.04 28.89,69.22 20.64,26.67 20.64,25.08 20.64,23.5 20.64,21.91 17.78,32.7 22.54,28.26 41.27,34.92 43.5,34.92 19.5,38.42
  pour Bottom (rank 4): 0,0 100,0 100,75 0,75
  pour Top (isolate 0.254, rank 4): 0,74.93 100.33,74.93 100.33,0 0,0
  pour Top (isolate 0.254, rank 5, no thermals): 31.75,59.69 31.75,69.85 25.72,69.85 25.4,69.53 23.18,69.53 22.86,69.85 12.7,69.85 12.7,59.69
  pour Top (isolate 0.254, rank 5, no thermals): 11.43,19.05 29.53,19.05 29.53,18.41 31.75,16.19 31.75,2.54 11.43,2.54
HPA_L
  Top 0.254: IC13.9 IC13.8 78.11,38.1 80.43,40.42 R75.1
HPA_R
  Top 0.254: R76.1 79.69,32.38 78.88,31.57 IC13.7 IC13.6
LINE
  Top 0.254: R40.2 71.44,6.35 71.12,6.67 71.12,10.16 70.8,10.48 68.26,10.48 66.99,9.21 R82.1 66.78,7.94 66.36,7.94 64.77,6.35 59.05,6.35 58.42,5.71 C56.1
  Top 0.406: C19.1 75.88,6.98 L1.1 | R33.2 76.3,7.4 L1.1 | R40.2 73.66,6.35 74.61,7.3 L1.1
MIC
  Top 0.254: R69.1 78.42,59.37 78.74,59.05 78.74,56.91 C48.1 80.64,56.83 81.28,57.47 85.41,57.47 X3.2
MIC+20  (via drill 0.3)
  Top 0.254: IC4.13 v72.42,58.42 | IC1.12 25.91,53.53 27.18,54.8 27.18,56.07 v27.3,56.2
  Bottom 0.254: v72.42,58.42 69.53,58.42 67.31,56.2 v27.3,56.2
MIC-10  (via drill 0.3)
  Top 0.254: IC15.1 58.2,53.44 v57.78,53.02 | v25.08,54.61 25.11,53.95 IC1.13
  Bottom 0.254: v57.78,53.02 54.29,53.02 52.7,54.61 v25.08,54.61
MIC_AUDIO
  Top 0.254: IC10.4 56.94,55.14 57.78,54.29 60.01,54.29 60.33,54.61 IC15.5 60.33,59.05 59.69,59.69 JP1.17
MIX_L  (via drill 0.3)
  Top 0.254: IC2.6 IC2.7 63.18,31.43 v66.36,31.43 | IC6.10 71.79,34.65 71.12,33.97 v70.17,33.97
  Bottom 0.254: v66.36,31.43 67.63,31.43 v70.17,33.97
MIX_R  (via drill 0.3)
  Top 0.254: IC2.1 IC2.2 v60.01,30.16 | v71.75,30.16 72.07,30.16 72.44,30.53 IC6.8
  Bottom 0.254: v71.75,30.16 v60.01,30.16
MUTE_MIC  (via drill 0.3)
  Top 0.254: IC10.1 54.08,53.44 v53.34,52.7 | IC1.11 27.71,49.76 27.62,49.85 v27.62,53.34
  Bottom 0.254: v53.34,52.7 52.07,53.98 28.26,53.98 v27.62,53.34
N$1
  Top 0.254: IC7.5 77.05,12.06 C24.2
N$2
  Top 0.254: IC7.8 77.15,15.88 77.47,15.56 C24.1
N$3
  Top 0.254: R36.1 C22.2 R32.2
  Top 0.305: IC7.2 68.58,14.61 67.94,15.24 67.94,18.1 68.26,18.41 R32.2
N$4
  Top 0.254: R32.1 68.26,22.54 68.58,22.86 70.8,22.86 71.75,23.81 71.75,24.75 C17.+
N$5  (via drill 0.3)
  Top 0.254: C22.1 R36.2 C25.1 75.03,21.49 76.83,19.68 76.83,17.14 79.06,14.92 v79.06,13.34 | 72.52,9.34 72.52,12.83 v73.03,13.34 IC7.6
  Top 0.305: C26.1 72.52,9.34 | 75.03,21.59 C25.1
  Bottom 0.254: v79.06,13.34 v73.03,13.34
N$6
  Top 0.254: IC8.12 54.93,23.18 55.56,23.81 57.47,23.81 | IC8.10 57.47,23.81 | R29.1 61.91,23.5 61.59,23.81 58.42,23.81 | C20.+ 58.42,23.81 | 58.42,23.81 57.47,23.81
  Top 0.305: R29.1 62.16,23.96 D1.A 65.47,23.96 R30.2 65.94,23.5 66.36,23.5 66.99,22.86 66.99,14.29 67.94,13.34 IC7.3
N$7  (via drill 0.3)
  Top 0.254: T2.1 32.7,10.79 32.07,11.43 v32.07,15.88 | v29.84,20.95 28.36,20.95 R46.2
  Bottom 0.254: v32.07,15.88 29.84,18.1 v29.84,20.95
N$8
  Top 0.406: X2.G 87.63,5.08 | 87.63,5.08 R31.1 | 87.63,5.08 C16.2
N$9  (via drill 0.3)
  Top 0.254: IC13.10 v76.83,35.56 | IC6.11 71.14,35.85 v71.12,35.56
  Bottom 0.254: v76.83,35.56 v71.12,35.56
N$10
  Top 0.254: 62.87,5.08 C58.1 66.43,5.15 66.99,5.71 R82.2
N$11
  Top 0.254: C28.2 62.13,11.75 R41.2 63.28,11.85 63.5,12.06 63.5,13.02 63.82,13.34 65.19,13.34 R42.2
N$12
  Top 0.254: C32.1 49.85,21.38 49.85,18.63 R47.2 51.44,17.78 52.07,18.41 53.98,18.41 54.93,17.46 IC8.3 54.93,13.97 55.24,13.65 55.24,11.85 R45.2
N$13
  Top 0.406: C18.1 78.42,6.98 L1.2 78,7.4 R33.1 83.19,9.53 85.09,11.43 85.09,16.51 X2.3
N$14
  Top 0.254: R51.2 R52.2 45.82,21.06 46.67,21.91 C35.+
N$15
  Top 0.254: IC8.2 53.66,14.19 R48.2 R44.1 53.87,9.55 C57.2
N$16
  Top 0.254: R42.1 65.41,8.57 64.45,7.62 57.78,7.62 56.52,6.35 54.29,6.35 53.98,6.03 C57.1
N$17  (via drill 0.3)
  Top 0.254: T4.1 32.37,26.97 31.75,26.35 C4.1 | R4.1 39.37,27.94 v39.37,29.84 | T4.1 | T4.1 31.75,27.94 v31.75,29.84 31.75,32.92 R1.2
  Bottom 0.254: v39.37,29.84 v31.75,29.84
N$18  (via drill 0.3)
  Top 0.254: IC6.6 v71.14,33.04 | v76.83,33.02 IC13.5
  Bottom 0.254: v71.14,33.04 76.81,33.04 v76.83,33.02
N$19
  Top 0.254: IC6.14 69.19,39.03 69.53,39.37 R7.2
N$20
  Top 0.254: R8.2 70.8,39.69 69.85,38.73 IC6.13
N$21
  Top 0.254: IC13.2 IC13.1 74.3,32.38 73.66,33.02 72.44,33.02 | IC6.9 72.44,33.02 | IC6.7 71.79,32.37 72.44,33.02
N$22
  Top 0.254: R74.2 75.25,38.4 75.25,38.42 75.56,38.1 IC13.12 IC13.3 75.56,30.8 75.25,30.48 75.03,30.48 R77.1
N$23
  Top 0.254: IC16.1 88.27,42.33 R78.2
  Top 0.406: C54.+ 88.27,40.32 IC16.1
N$24
  Top 0.254: IC16.7 87,32.6 R79.2
  Top 0.406: C55.+ 91.61,33.51 90.49,32.38 R79.2
N$25
  Top 0.254: C29.2 55.64,46.27 55.88,46.04 57.15,46.04 58.1,45.09 58.1,43.92 R62.1
N$26
  Top 0.406: C42.1 74.74,26.67 D2.C 76.02,25.58 76.52,25.08 L3.2
N$27
  pour Top (isolate 0.254, no thermals): 13.02,17.14 16.19,17.14 16.19,13.65 15.88,13.34 15.88,11.43 16.83,10.48 20,10.48 20,8.26 18.41,8.26 18.41,6.99 16.83,6.99 16.19,7.62 13.02,7.62
N$28
  Top 0.254: IC5.6 37.8,25.92 R5.1 R6.2
N$29
  Top 0.61: C3007.1 19.05,5.72 19.68,5.08 IC3001.1
N$30
  Top 0.254: R103.1 25.5,68.58 24.13,68.58 R102.2 24.03,68.58 23.5,68.58 22.94,68.03 IC101.3
  Top 0.305: R103.1 C103.2
N$31
  Top 0.254: R45.1 57.05,9.95 57.78,9.21 58.17,9.21 C56.2 C58.2
N$32
  Top 0.305: R54.1 40.32,6.03 40.15,6.2 40.15,6.35 T3.2
N$33
  Top 0.254: 42.23,7.8 C34.2 42.12,8.8
  Top 0.305: T3.1 42.23,7.8 | R50.2 R53.1 42.12,8.8
N$34
  Top 0.254: R50.1 37.47,12.7 | 37.47,12.7 C33.1 | R49.2 37.47,12.7
N$35
  Top 0.305: C55.- 98,34.61 R81.2
  Top 0.406: X3.4 88.58,48.9 93.66,43.81 93.66,37.78 95.57,35.88 95.57,34.75 C55.-
N$36
  Top 0.305: C54.- 97.37,40.32 R80.2
  Top 0.406: C54.- 95.71,43.99 87.63,52.07 X3.5
N$37
  Top 0.254: T2.3 35.39,10.62 35.88,11.11 37.25,11.11 R49.1
N$38
  Top 0.406: IC16.3 85.72,38.73 85.09,38.1 81.29,38.1 C50.+
N$39
  Top 0.254: IC3.12 43.28,20.32 R21.2 R20.1
N$40
  Top 0.254: D6.C 76.2,54.59 | 76.2,54.59 D5.A | 76.2,54.59 76.2,56.83 C48.2 74.61,56.83 74.3,56.52 74.3,55.88 73.92,55.5 IC4.14
N$41
  Top 0.254: IC3.9 IC3.8
N$42
  Top 0.254: R51.1 47.31,17.57 47.31,15.24 48.58,13.97 R48.1 52.39,14.19 IC8.1
N$43
  Top 0.254: IC11.6 53.24,31.77 C41.1
N$44
  Top 0.254: R25.2 72.71,59.69 72.42,59.98 IC4.2
N$45
  Top 0.254: IC4.1 73.4,61.34 73.98,61.91 R26.2 74.72,61.81 75.56,60.96 75.56,60.64 76.42,59.79 R25.1
N$46
  Top 0.254: C49.+ 75.58,64.44 76.2,63.82 76.2,62.02 R26.1
N$47
  Top 0.254: IC4.12 71.77,54.28 73.03,53.02 73.28,53.02
  Top 0.406: C59.+ 73.28,52.49 73.28,53.02
N$48
  Top 0.254: R28.2 C65.1 93.03,70.06 93.03,66.99 93.35,66.67 X3.G
N$49
  Top 0.254: R60.2 58.32,35.88 59.69,35.88 60.01,36.2 IC2.13 60.01,39.27 R61.1
N$50
  Top 0.254: IC3.6 37.47,18.41 37.78,18.1 37.78,15.88 | 37.78,15.88 37.78,14.92 38.42,14.29 42.86,14.29 43.71,13.44 R17.2 R16.1 | C13.1 37.78,15.88
N$51
  Top 0.254: IC3.5 34.19,19.05 R18.1 33.97,19.05 31.96,19.05 R15.2 R14.1
N$52
  Top 0.254: R10.2 R9.2 39.37,23.39 39.37,20.95 38.73,20.32 IC3.3
N$53
  Top 0.254: IC3.2 34.19,20.95 R11.1
N$54
  Top 0.254: IC5.5 37.15,24.34 R10.1
N$55
  Top 0.254: IC1.29 14.65,44.92 C6.1
N$56  (via drill 0.4)
  Top 0.406: C51.1 89.32,36.62 88.27,35.56 IC16.8
  Top 0.61: v91.44,43.5 90.17,44.77 76.98,44.77 C53.+ 76.69,44.77 74.93,44.77 74.3,44.13 L2.2 | v91.44,37.47 91.44,37.15 90.81,36.51 90.27,36.51 C51.1
  Bottom 0.61: v91.44,43.5 v91.44,37.47
N$57
  Top 0.254: IC4.3 71.77,66.98 71.12,67.63 69.55,67.63 C61.-
N$58
  Top 0.254: IC4.4 IC4.5 70.47,63.2 69.85,63.82 69.85,64.12 C61.+
N$59
  Top 0.254: IC1.7 29.38,46.52 29.84,46.99 33.34,46.99 33.97,46.35 33.97,46.16 Q1.1 34.19,45.84 C1.1
N$60
  Top 0.254: IC1.8 29.22,47.32 29.84,47.94 32.29,47.94 Q1.3 32.49,48.14 C2.1
N$61
  Top 0.254: IC4.11 R23.2
N$62  (via drill 0.3)
  Top 0.254: IC4.6 IC4.7 68.2,61.34 67.63,61.91 v67.63,62.87 | v60.64,62.87 62.53,62.87 C60.+
  Bottom 0.254: v60.64,62.87 v67.63,62.87
N$63
  Top 0.254: R35.1 59.26,56.62 R27.2 59.67,56.63 IC15.6
N$64
  Top 0.254: R69.2 C66.+ 85.79,64.2 86.36,64.77 86.36,70.06 R70.1
N$65
  Top 0.254: IC15.4 60.98,56.63 R27.1 | R27.1 60.96,56.83 | R27.1 61.28,56.83 62.23,57.78 C60.-
N$66
  Top 0.254: R41.1 62.13,13.65 60.33,13.65 60.22,13.76 R39.2 60.01,14.19 IC8.7
N$67
  Top 0.254: IC9.4 49.35,40.19 49.21,40.32 48.58,40.32 48.26,40.64 48.26,43.18 48.9,43.81 50.15,43.81 C36.+ 49.85,43.48 49.85,43.18
N$68
  Top 0.254: IC9.5 47.1,39.26 45.4,40.96 C37.+
N$69
  Top 0.254: R63.1 58.42,41.59 58.42,39.59 R61.2 59.37,38.2 IC2.14
N$70  (via drill 0.3)
  Top 0.254: v58.74,18.1 IC8.6 58.74,14.19 R39.1 | v54.93,19.05 52.39,19.05 51.44,20 R38.2
  Bottom 0.254: v58.74,18.1 55.88,18.1 v54.93,19.05
N$71
  Top 0.254: IC9.6 47.31,35.03 R56.2
N$72
  Top 0.254: IC2.12 60.64,35.88 58.74,33.97 R59.1 58.1,33.87 58.1,32.38 57.47,31.75 C41.2
N$73
  Top 0.254: IC2.10 61.91,40.96 61.28,41.59 R63.2 R62.2 R64.1
N$75
  Top 0.254: IC2.8 63.18,38.84 R67.1 R68.1 63.08,41.39 R64.2
N$76
  Top 0.254: IC8.5 57.47,14.92 56.2,13.65 56.2,8.57 55.24,7.62 C23.+ 49.53,7.63 49.53,8.89 50.48,9.84 R37.2
N$77
  Top 0.254: IC8.9 IC8.8
N$78
  Top 0.254: IC2.5 61.91,32.7 64.67,35.46 R67.2 65.72,39.05 66.36,39.69 66.36,41.59 66.99,42.23 R65.2
N$79
  Top 0.254: IC2.3 60.64,33.97 61.59,34.92 63.18,34.92 63.82,35.56 63.82,40.32 64.67,41.17 R68.2 64.77,41.38 R66.2
N$80
  Top 0.254: IC10.6 54.28,55.97 R57.2
N$81
  cutout Top: 97.79,10.48 92.71,10.48 92.71,7.3 97.79,7.3
N$82
  Top 0.254: IC4.10 70.47,54.28 69.22,53.02 67.94,53.02
  Top 0.406: 69.22,53.02 68.58,53.02 C62.+
N$83
  Top 0.305: T5.3 R70.2
N$84
  Top 0.254: IC12.1 41.6,38.27 IC17.6 IC17.7
N$85  (via drill 0.3)
  Top 0.254: v37.15,34.29 40.64,34.29 41.6,33.33 IC17.3 | IC12.7 39.12,38.8 v37.15,36.83
  Bottom 0.254: v37.15,34.29 v37.15,36.83
N$86
  cutout Bottom: 92.71,10.48 97.79,10.48 97.79,7.3 92.71,7.3
N$6434
  Top 0.254: IC16.6 85.72,32.6 R79.1
  Top 0.406: R76.2 R79.1
N$19213
  Top 0.254: IC16.2 87,42.33 R78.1 R75.2
RX_AUD_FLT  (via drill 0.3)
  Top 0.254: IC9.8 49.85,37.15 | 49.85,37.15 IC9.3 | 49.85,37.15 R19.1 R55.1 45.3,39.05 v44.45,39.05 | v40.96,44.13 40.96,48.9 45.72,53.66 45.72,63.5 46.35,64.14 50.48,64.14 52.07,65.72 JP1.11
  Bottom 0.254: v44.45,39.05 44.45,40.96 45.09,41.59 45.09,43.18 44.13,44.13 v40.96,44.13
RX_AUD_LIM
  Top 0.254: IC9.9 50.35,36.7 50.48,36.83 50.48,36.93 R19.2 | R19.2 50.48,37.15 | R19.2 51.44,37.15 51.75,37.47 51.75,38.42 53.34,40.01 53.34,43.71 R58.1 53.44,44.55 53.98,45.09 53.98,48.26 53.02,49.21 49.53,49.21 48.58,50.16 48.58,61.59 49.53,62.55 52.07,62.55 53.34,63.82 53.34,68.58 JP1.14
RX_AUD_RET
  Top 0.254: IC11.5 51.75,31.11 51.44,31.43 51.44,33.34 52.07,33.97 53.02,33.97 53.66,34.61 53.66,37.78 54.61,38.73 54.61,40.64 55.24,41.27 55.24,42.55 54.93,42.86 54.93,43.71 R58.2 | 54.93,43.4 R58.2 | R58.2 55.14,43.92 54.93,44.13 54.93,44.77 54.61,45.09 54.61,48.9 53.66,49.85 49.85,49.85 49.21,50.48 49.21,61.28 49.85,61.91 52.39,61.91 54.61,64.14 JP1.13
RX_AUDIO  (via drill 0.3)
  Top 0.254: C35.- 46.35,26.99 46.35,28.57 46.04,28.89 46.04,31.11 46.35,31.43 46.35,36.3 R55.2 43.81,37.15 43.18,37.78 43.18,41.59 43.5,41.91 v43.5,42.55 | JP1.12 50.8,68.58 50.8,65.41 50.16,64.77 46.04,64.77 45.09,63.82 45.09,53.98 40.32,49.21 40.32,45.09 40.01,44.77 v40.01,42.55
  Bottom 0.254: v43.5,42.55 v40.01,42.55
SCL  (via drill 0.3)
  Top 0.254: R7.1 69.53,42.55 68.9,43.18 v68.9,45.09 | JP1.8 45.72,68.58 43.81,68.58 43.18,67.94 43.18,55.56 37.47,49.85 v37.47,48.26 37.47,41.91 38.42,40.96 38.42,40.01 38.62,39.8 IC12.5 | IC1.19 20.31,49.23 20.32,48.9 v20.32,47.94 | CN1.5 14.45,27.46 14.61,27.3 14.61,25.08 13.97,24.45 6.35,24.45 5.71,23.81 3.49,23.81 2.54,24.77 2.54,51.44 v3.81,52.7 5.08,53.98 R72.1 | v8.89,52.7 v13.97,52.7
  Bottom 0.254: v68.9,45.09 61.28,45.09 58.1,48.26 v37.47,48.26 21.27,48.26 20.95,47.94 v20.32,47.94 16.19,47.94 14.61,49.53 14.61,52.07 v13.97,52.7 | v3.81,52.7 v8.89,52.7
SDA  (via drill 0.3)
  Top 0.254: IC12.4 41.63,40.6 41.27,40.96 39.37,40.96 38.1,42.23 38.1,47.62 38.42,47.94 v38.42,49.21 38.42,49.85 43.81,55.24 43.81,65.09 44.45,65.72 JP1.5 | v68.26,46.67 68.9,46.67 69.85,45.72 69.85,43.18 70.8,42.23 R8.1 | IC1.20 v19.51,49.21 | CN1.6 14.9,27.96 15.24,27.62 15.24,24.77 14.29,23.81 6.67,23.81 6.03,23.18 3.17,23.18 1.91,24.45 1.91,54.29 v2.86,55.24 R73.1 | v8.89,54.29 v16.19,54.29
  Bottom 0.254: v68.26,46.67 60.64,46.67 58.42,48.9 40.01,48.9 39.69,49.21 v38.42,49.21 36.83,49.21 36.51,48.9 20.64,48.9 20.32,49.21 v19.51,49.21 16.51,49.21 15.56,50.16 15.56,52.39 16.19,53.02 v16.19,54.29 | v2.86,55.24 3.81,54.29 v8.89,54.29
ST_IN
  Top 0.254: C23.- 46.34,7.63 46.04,7.62 46.04,15.24 44.77,16.51 44.77,22.54 43.18,24.13 43.18,30.16 42.86,30.48 41.27,30.48 40.95,30.81 IC17.2 IC17.1
SW_HV
  pour Top (no thermals): 22.54,65.41 22.54,60.64 27.94,60.64 27.94,63.82 23.5,63.82 23.5,65.41
TC_IN
  Top 0.254: IC1.15 23.51,55.26 25.4,57.15 37.15,57.15 38.1,58.1 38.1,67.94 38.73,68.58 40.64,68.58 JP1.4
TX_AUDIO  (via drill 0.3)
  Top 0.254: v61.91,26.04 66.99,26.04 68.26,24.77 C17.- | R43.2 50.9,55.35 51.44,55.88 51.44,59.05 57.15,64.77 JP1.15 | v44.45,26.04 44.45,32.38 42.25,34.59 IC17.5 42.25,37.49 42.55,37.78 42.55,42.86 43.5,43.81 43.5,48.26 v46.35,51.12 | 50.8,54.29 50.9,54.08 R43.2 | v50.8,51.12 50.8,54.19 R43.2
  Bottom 0.254: v61.91,26.04 v44.45,26.04 | v46.35,51.12 v50.8,51.12
TX_INT
  Top 0.254: IC10.5 54.93,54.61 54.61,54.29 R43.1 52.7,54.4 52.7,55.24 52.07,55.88 52.07,58.74 58.42,65.09 58.42,68.58 JP1.18
TXA  (via drill 0.3)
  Top 0.254: R16.2 44.45,3.81
  Top 0.406: C26.2 69.72,6.37 R40.1 69.53,6.18 v69.53,3.81 44.45,3.81 41.59,3.81 41.59,3.98 T3.3
  Bottom 0.406: TP1.TP v69.53,3.81
V+  (via drill 0.3)
  Top 0.254: C27.1 63.19,18.1 v63.82,18.1 D1.K | C34.1 40.32,8.26 | 40.32,10.38 R53.2
  Top 0.305: R29.2 61.91,21.91 63.67,21.91 D1.K | R54.2 39.69,7.93 39.69,7.94 C34.1 | 40.32,8.26 40.32,10.38 | R53.2 39.37,10.48 39.05,10.79 v39.05,11.43
  Top 0.406: C21.1 73.03,17.78 73.03,14.92 73.34,14.61 IC7.7 | C27.1 60.64,18.1 59.69,19.05 57.15,19.05 56.2,18.1 IC8.4 56.2,14.92 v55.88,14.61 | v76.52,21.59 78.61,21.59 C31.1 78.42,22.04 L3.1
  Top 0.61: C21.1 v75.25,17.78 | D9.A 34.29,4.13 v35.88,4.13
  Bottom 0.406: v63.82,18.1 66.36,18.1 67.31,19.05 75.25,19.05 | 75.25,19.05 v75.25,17.78 | v76.52,21.59 76.52,20.32 75.25,19.05 | v55.88,14.61 52.7,11.43 v39.05,11.43 36.83,11.43 35.88,10.48 v35.88,4.13
V_BUS
  Top 0.406: D2.A 81.6,26.67 82.55,25.72 X2.2
V_I+
  Top 0.254: R12.2 22.64,21.06 20.95,19.37 IC3001.7
  Top 0.406: 30.02,7.62 C45.+
  Top 0.61: D9.C 30.3,7.17 29.84,7.3 29.99,7.3 C45.+
  pour Top (isolate 0.254, no thermals): 20.64,10.48 20.64,7.3 20.95,6.99 30.48,6.99 30.48,9.53 27.94,9.53 26.99,10.48 26.04,10.48 26.04,8.26 24.77,8.26 24.13,7.62 21.59,7.62 21.27,7.94 21.27,10.48
VBUS_SENSE
  Top 0.254: R12.1 C10.1 R13.2 23.71,24.13 22.54,24.13 21.59,25.08 21.59,27.94 18.71,30.82 IC1.35
VCC  (via drill 0.3)
  Top 0.254: IC3.4 37.78,19.68 39.05,18.41 v39.05,18.1 39.05,16.83 | 39.05,16.83 39.05,15.98 C11.1 | R20.2 43.5,16.83 39.05,16.83 | IC5.2 37.15,30.7 C9.1 36.83,30.8 | IC10.2 54.93,52.7 54.61,52.39 54.61,51.65 C38.1 | IC3001.4 23.5,3.49 v24.77,3.49 | IC1.5 28.74,44.92 29.53,44.13 29.95,44.13 C3.1 | IC1.38 21.11,37.83 C8.1 | C44.+ 28.27,13.66 v28.26,13.65 | 38.31,35.24 C68.1 39.77,36.49 IC17.8 | IC12.6 38.35,39.3 38.1,39.05 37.36,39.05 C67.1 36.83,38.73 | IC15.2 60.33,51.45 C63.2 v58.74,51.44 | C43.1 28.57,15.66 | 34.92,35.34 R22.2 | R71.2 78.42,69.22 | CN1.12 12.54,30.96 11.75,31.75 | CN1.15 12.46,32.46 11.75,31.75 | 11.75,31.75 v10.16,31.75 | R73.2 R72.2 5.08,60.64 v7.62,60.64 | R14.2 29.84,15.56 | v2.22,17.78 R3.1
  Top 0.305: T5.2 78.42,69.22 76.52,69.22 v76.2,69.22
  Top 0.406: C52.1 71.44,47.31 71.12,46.99 v71.12,45.72 L2.1 | v53.02,51.44 C38.1 | 21.91,46.52 IC1.27 C7.1 13.55,47.09 13.02,47.62 v9.21,47.62 | 21.91,46.52 21.91,49.85 | 21.91,49.85 IC1.17 C5.1 | IC1.5 24.3,44.92 23.66,45.55 21.91,45.55 | 21.91,46.52 21.91,45.55 | IC1.38 21.11,44.76 21.91,45.55 | R22.2 36.2,35.24 | 36.2,35.24 38.31,35.24 | C9.1 37.05,31.54 36.2,32.38 36.2,35.24 | 34.92,35.34 v34.92,38.73 36.83,38.73 | v58.74,51.44 57.15,49.85 v57.15,46.99 | v56.52,43.5 56.52,39.69 54.61,37.78 54.61,33.34 54.93,33.02 54.93,30.16 54.61,29.84 L4.2 | v25.08,49.85 21.91,49.85 | v20.32,71.12 20.32,69.32 C102.1
  Top 0.61: v13.97,60.33 15.56,62.23
  Bottom 0.254: v24.77,3.49 v24.77,12.7 | 5.08,17.78 v2.22,17.78
  Bottom 0.305: v76.2,69.22 66.36,69.22 65.72,68.58 57.15,68.58
  Bottom 0.406: v71.12,45.72 68.26,48.58 61.59,48.58 v58.74,51.44 v53.02,51.44 52.39,52.07 29.84,52.07 27.62,49.85 v25.08,49.85 | JP1.9 49.53,68.58 | 49.53,68.58 57.15,68.58 JP1.16 | 49.53,68.58 34.29,68.58 31.75,71.12 v20.32,71.12 | v28.26,13.65 33.66,13.65 35.24,15.24 38.1,15.24 39.05,16.51 v39.05,18.1 | v57.15,46.99 57.15,45.09 56.52,44.45 v56.52,43.5 | SV1.2 5.08,10.16 5.08,17.78 6.03,18.73 10.16,18.73 | 10.16,56.2 8.57,56.2 7.62,57.15 v7.62,60.64
  Bottom 0.61: v28.26,13.65 v27.62,14.29 14.61,14.29 10.16,18.73 v10.16,31.75 10.16,36.83 | v13.97,60.33 13.97,57.78 12.38,56.2 10.16,56.2 10.16,48.58 v9.21,47.62 3.49,47.62 2.54,46.67 2.54,38.1 3.81,36.83 10.16,36.83 | v34.92,38.73 31.11,38.73 29.21,36.83 10.16,36.83
  pour Top (isolate 0.254, rank 3, no thermals): 20.95,69.85 19.37,69.85 19.37,66.36 17.46,66.36 17.46,63.82 14.29,63.82 14.29,61.59 13.65,60.96 13.65,60.01 14.29,60.01 14.92,60.64 20,60.64 20,64.45 20.64,64.45 20.95,64.77 20.95,65.72 20.64,66.04 20.64,66.67 20.95,66.99
  pour Top (no thermals): 22.54,17.14 26.35,17.14 26.35,16.19 30.48,16.19 30.48,13.02 27.94,13.02 26.99,12.06 23.5,12.06 22.54,13.02

## Text on the board
Top: T
Bottom: B
tPlace: Mic AMP & Bias | MIC Level Ctl | Headphone drv. | ST Ctl | Mix | Limiter | Volume | Line drv | Call drv | Line RX
bStop: Beltpack V1 | A.Lang 2019